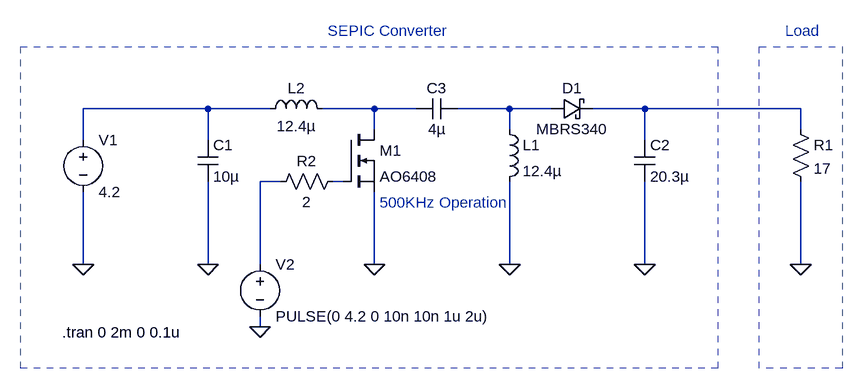
[diagram p0: schematic SEPIC_Converter.asc]
SEPIC_Converter.asc, the LTspice schematic file:
Version 4
SHEET 1 1140 680
WIRE 160 112 -32 112
WIRE 256 112 160 112
WIRE 416 112 336 112
WIRE 480 112 416 112
WIRE 624 112 544 112
WIRE 688 112 624 112
WIRE 832 112 752 112
WIRE 1072 112 832 112
WIRE 416 144 416 112
WIRE 624 144 624 112
WIRE 1072 144 1072 112
WIRE -32 160 -32 112
WIRE 160 160 160 112
WIRE 832 160 832 112
WIRE 272 224 240 224
WIRE 368 224 352 224
WIRE -32 352 -32 240
WIRE 160 352 160 224
WIRE 240 352 240 224
WIRE 416 352 416 240
WIRE 624 352 624 224
WIRE 832 352 832 224
WIRE 1072 352 1072 224
WIRE 240 448 240 432
FLAG -32 352 0
FLAG 160 352 0
FLAG 624 352 0
FLAG 832 352 0
FLAG 416 352 0
FLAG 1072 352 0
FLAG 240 448 0
SYMBOL voltage -32 144 R0
WINDOW 123 0 0 Left 2
WINDOW 39 0 0 Left 2
SYMATTR Value2 ""
SYMATTR SpiceLine ""
SYMATTR InstName V1
SYMATTR Value 4.2
SYMBOL cap 144 160 R0
SYMATTR InstName C1
SYMATTR Value 10µ
SYMATTR SpiceLine ""
SYMBOL cap 816 160 R0
SYMATTR InstName C2
SYMATTR Value 20.3µ
SYMATTR SpiceLine ""
SYMBOL cap 544 96 R90
WINDOW 0 0 32 VBottom 2
WINDOW 3 32 32 VTop 2
SYMATTR InstName C3
SYMATTR Value 4µ
SYMATTR SpiceLine ""
SYMBOL ind 608 128 R0
SYMATTR InstName L1
SYMATTR Value 12.4µ
SYMATTR SpiceLine ""
SYMBOL ind 240 128 R270
WINDOW 0 32 56 VTop 2
WINDOW 3 5 56 VBottom 2
SYMATTR InstName L2
SYMATTR Value 12.4µ
SYMBOL schottky 688 128 R270
WINDOW 0 32 32 VTop 2
WINDOW 3 0 32 VBottom 2
SYMATTR InstName D1
SYMATTR Value MBRS340
SYMATTR Description Diode
SYMATTR Type diode
SYMBOL nmos 368 144 R0
SYMATTR InstName M1
SYMATTR Value AO6408
SYMBOL res 1056 128 R0
SYMATTR InstName R1
SYMATTR Value 17
SYMATTR SpiceLine ""
SYMBOL voltage 240 336 R0
WINDOW 123 0 0 Left 2
WINDOW 39 0 0 Left 2
SYMATTR Value2 ""
SYMATTR SpiceLine ""
SYMATTR InstName V2
SYMATTR Value PULSE(0 4.2 0 10n 10n 1u 2u)
SYMBOL res 368 208 R90
WINDOW 0 0 56 VBottom 2
WINDOW 3 32 56 VTop 2
SYMATTR InstName R2
SYMATTR Value 2
TEXT -64 456 Left 2 !.tran 0 2m 0 0.1u
TEXT 1048 -8 Left 2 ;Load
TEXT 344 -8 Left 2 ;SEPIC Converter
TEXT 424 256 Left 2 ;500KHz Operation
RECTANGLE Normal 944 512 -128 16 2
RECTANGLE Normal 1136 512 1008 16 2

The netlist it stands for:
* SEPIC_Converter.asc
V1 N001 0 4.2
C1 N001 0 10µ
C2 N004 0 20.3µ
C3 N003 N002 4µ
L1 N003 0 12.4µ
L2 N001 N002 12.4µ
D1 N003 N004 MBRS340
M1 N002 N006 0 0 AO6408
R1 N004 0 17
V2 N005 0 PULSE(0 4.2 0 10n 10n 1u 2u)
R2 N006 N005 2
.model D D
.lib standard.dio
.model NMOS NMOS
.model PMOS PMOS
.lib standard.mos
.tran 0 2m 0 0.1u
* Load
* SEPIC Converter
* 500KHz Operation
.backanno
.end